# EAGLE design Quark.One (EAGLE 7.3.0)
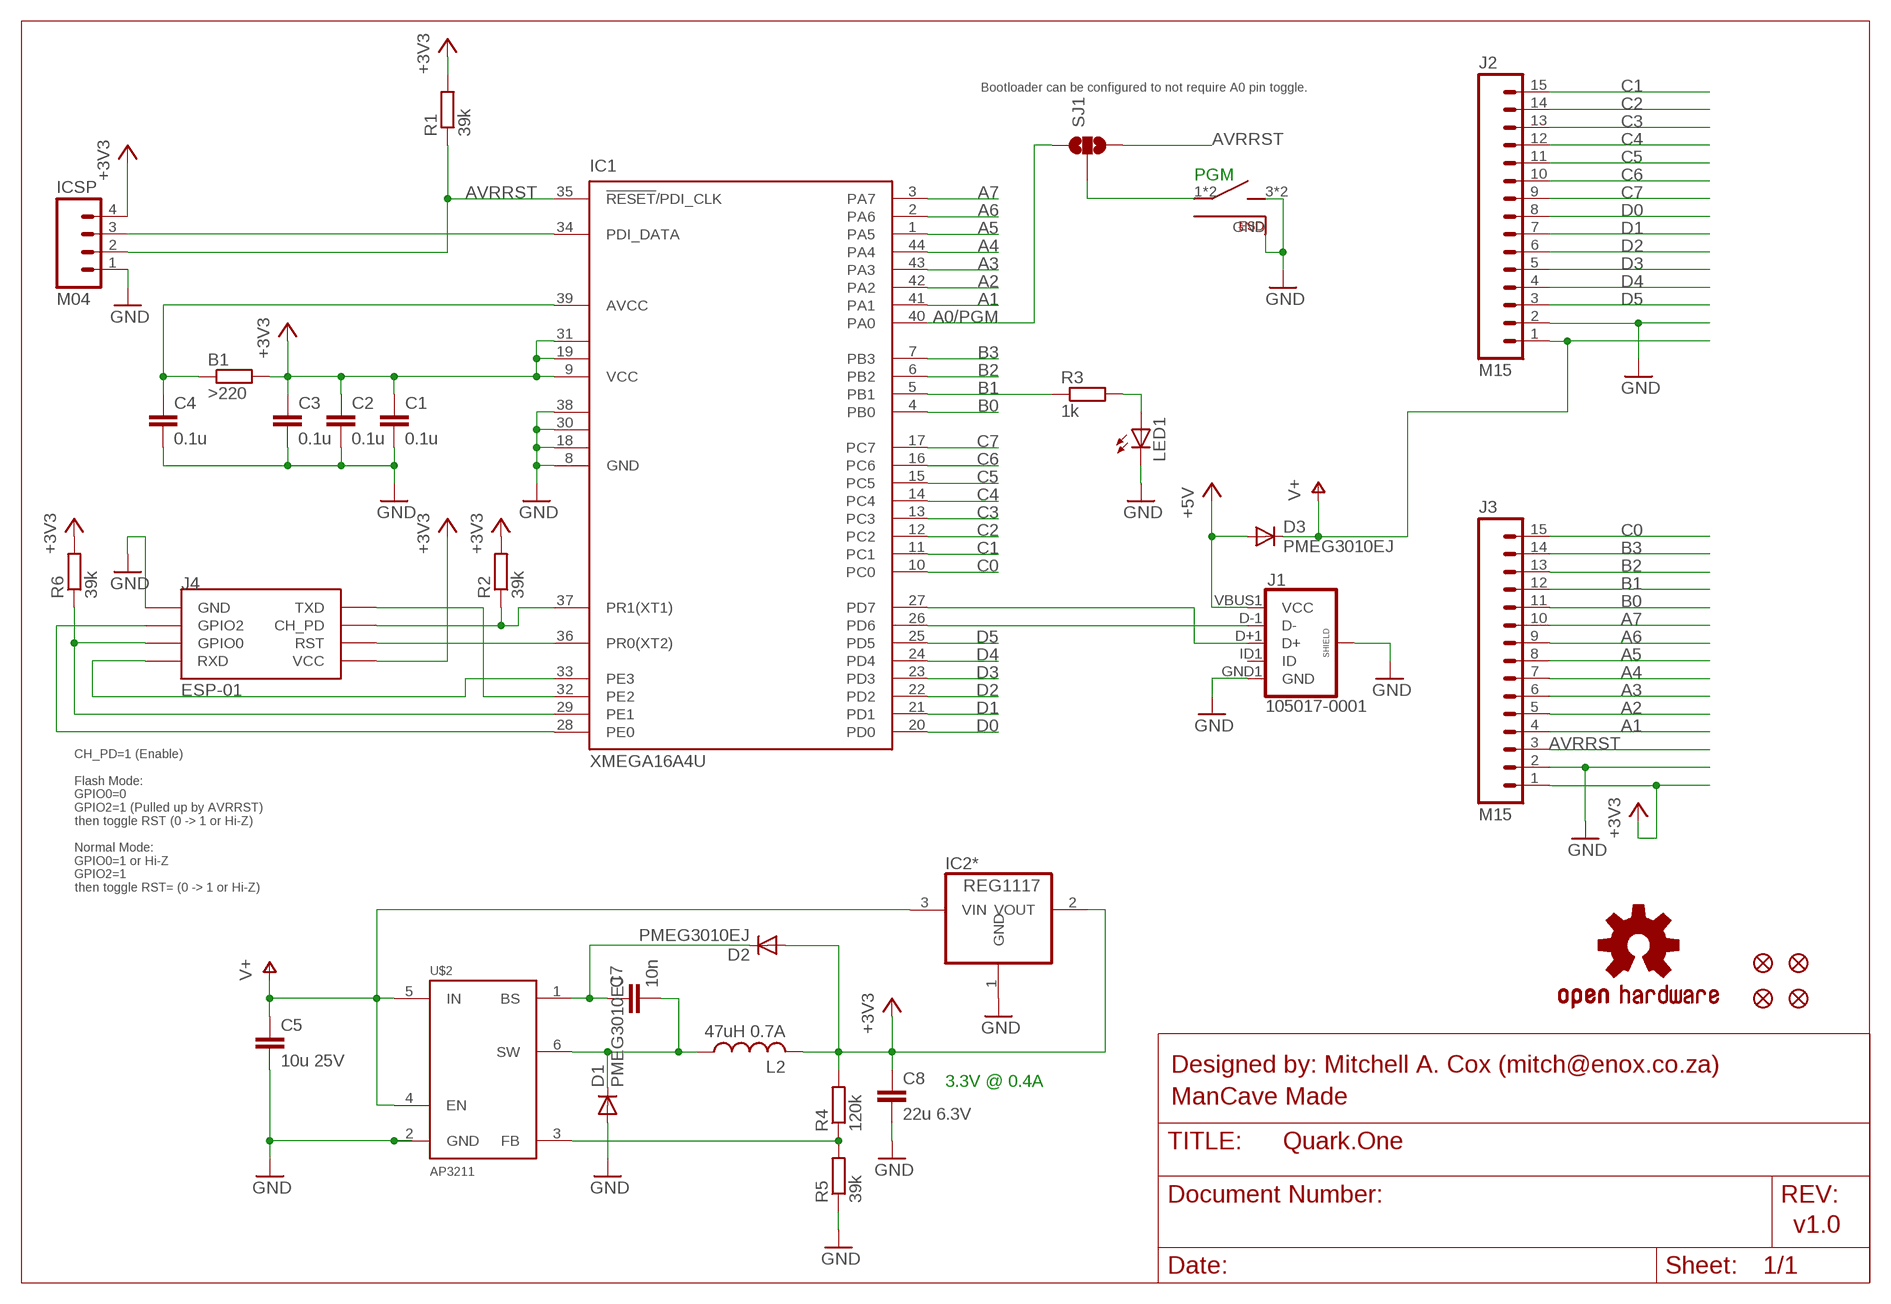
[diagram p0: schematic, sheet 1]

## Parts
B1  >220  R-EU_R0603  [R0603]
C1  0.1u  C-EUC0603  [C0603]
C2  0.1u  C-EUC0603  [C0603]
C3  0.1u  C-EUC0603  [C0603]
C4  0.1u  C-EUC0603  [C0603]
C5  10u 25V  C-EUC0805  [C0805]
C7  10n  C-EUC0603  [C0603]
C8  22u 6.3V  C-EUC0805  [C0805]
D1  PMEG3010EJ  DIODESOD  [SOD-323]
D2  PMEG3010EJ  DIODESOD  [SOD-323]
D3  PMEG3010EJ  DIODESOD  [SOD-323]
IC1  XMEGA16A4U  XMEGA16A4A  [TQFP44]
IC2*  REG1117  [SOT223]
ICSP  M04  [1X04-LOCK]
J1  105017-0001  USB-MICRO  [USB-MICROB]
J2  M15  [1X15]
J3  M15  [1X15]
J4  ESP-01  ESP01  [ESP01]
JP1  FIDUCIALUFIDUCIAL  [MICRO-FIDUCIAL]
JP2  FIDUCIALUFIDUCIAL  [MICRO-FIDUCIAL]
JP3  FIDUCIALUFIDUCIAL  [MICRO-FIDUCIAL]
JP4  FIDUCIALUFIDUCIAL  [MICRO-FIDUCIAL]
L2  47uH 0.7A  L  [LQH44P]
LED1  LEDCHIPLED_0603  [CHIPLED_0603]
R1  39k  R-EU_R0603  [R0603]
R2  39k  R-EU_R0603  [R0603]
R3  1k  R-EU_R0603  [R0603]
R4  120k  R-EU_R0603  [R0603]
R5  39k  R-EU_R0603  [R0603]
R6  39k  R-EU_R0603  [R0603]
S1  PTS840  [PTS840-SW]
SJ1  SOLDERJUMPER_2WAY-OLDPASTE2&3  [SJ_3_PASTE2&3]
U$1  OSHW  [OSHW-S]
U$2  AP3211  [SOT23-6]

## Nets
+3V3: B1.2 C1.1 C2.1 C3.1 C8.1 D2.2(A) IC1.9(VCC) IC1.19(VCC1) IC1.31(VCC2) IC2*.2(VOUT) ICSP.4 J3.1 J4.VCC L2.2 R1.2 R2.2 R4.2 R6.2
+5V: D3.2(A) J1.VBUS1(VCC)
A0/PGM: IC1.40(PA0) SJ1.1
A1: IC1.41(PA1) J3.4
A2: IC1.42(PA2) J3.5
A3: IC1.43(PA3) J3.6
A4: IC1.44(PA4) J3.7
A5: IC1.1(PA5) J3.8
A6: IC1.2(PA6) J3.9
A7: IC1.3(PA7) J3.10
AVRRST: IC1.35(!RESET!/PDI_CLK) ICSP.2 J3.3 R1.1 SJ1.3
B0: IC1.4(PB0) J3.11
B1: IC1.5(PB1) J3.12 R3.1
B2: IC1.6(PB2) J3.13
B3: IC1.7(PB3) J3.14
C0: IC1.10(PC0) J3.15
C1: IC1.11(PC1) J2.15
C2: IC1.12(PC2) J2.14
C3: IC1.13(PC3) J2.13
C4: IC1.14(PC4) J2.12
C5: IC1.15(PC5) J2.11
C6: IC1.16(PC6) J2.10
C7: IC1.17(PC7) J2.9
D0: IC1.20(PD0) J2.8
D1: IC1.21(PD1) J2.7
D2: IC1.22(PD2) J2.6
D3: IC1.23(PD3) J2.5
D4: IC1.24(PD4) J2.4
D5: IC1.25(PD5) J2.3
GND: C1.2 C2.2 C3.2 C4.2 C5.2 C8.2 D1.2(A) IC1.8(GND) IC1.18(GND1) IC1.30(GND2) IC1.38(GND3) IC2*.1(GND) ICSP.1 J1.GND1(GND) J1.P$1(SHIELD) J1.P$2(SHIELD) J1.P$7(SHIELD) J1.P$8(SHIELD) J1.SHIELD J1.SHIELD2(SHIELD) J2.2 J3.2 J4.GND LED1.C R5.1 S1.3 S1.4 S1.GND U$2.2(GND)
N$1: LED1.A R3.2
N$2: IC1.32(PE2) J4.TX(TXD)
N$3: C7.2 D1.1(C) L2.1 U$2.6(SW)
N$4: IC1.34(PDI_DATA) ICSP.3
N$5: B1.1 C4.1 IC1.39(AVCC)
N$6: R4.1 R5.2 U$2.3(FB)
N$7: IC1.33(PE3) J4.RX(RXD)
N$8: IC1.26(PD6) J1.D-1(D-)
N$9: IC1.27(PD7) J1.D+1(D+)
N$10: C7.1 D2.1(C) U$2.1(BS)
N$12: IC1.37(PR1(XT1)) J4.CH_PD R2.1
N$13: IC1.36(PR0(XT2)) J4.RST
N$14: IC1.28(PE0) J4.GPIO2
N$15: IC1.29(PE1) J4.GPIO0 R6.1
N$17: S1.1 S1.2 SJ1.2
V+: C5.1 D3.1(C) IC2*.3(VIN) J2.1 U$2.4(EN) U$2.5(IN)
Unconnected: J1.ID1(ID)

## Notes on the sheet
- Bootloader can be configured to not require A0 pin toggle.
- PGM
- CH_PD=1 (Enable)
  
  Flash Mode:
  GPIO0=0
  GPIO2=1 (Pulled up by AVRRST)
  then toggle RST (0 -> 1 or Hi-Z)
  
  Normal Mode:
  GPIO0=1 or Hi-Z
  GPIO2=1
  then toggle RST= (0 -> 1 or Hi-Z)
- 3.3V @ 0.4A
- Designed by: Mitchell A. Cox (mitch@enox.co.za)
  ManCave Made
- v1.0

## Library data of the parts
B1 R1-R6 = rcl:R-EU_: RESISTOR, European symbol
C1-C5 C7 C8 = rcl:C-EU: CAPACITOR, European symbol
D1-D3 = SparkFun:DIODE: Diode These are standard reverse protection diodes and small signal diodes. SMA package can handle up to about 1A. SOD-323 can handle about 200mA. What the SOD-323 package when ordering, there are some mfgs out there that are 5-pin packages.
IC1 = atmel:XMEGA16A4: MICROCONTROLLER Features High-performance, Low-power 8/16-bit AVR XMEGA Microcontroller Non-Volatile Program and Data Memories - 16 KB - 128 KB of In-System Self-Programmable Flash - 4 KB - 8 KB Boot Code Section with Independent Lock Bits - 1 KB - 2 KB EEPROM - 2 KB - 8 KB Internal SRAM Peripheral Features - Four-channel DMA Controller with support for external requests - Eight-channel Event System - Five 16-bit Timer/Counters Three Timer/Counters with 4 Output Compare or Input Capture channels Two Timer/Counters with 2 Output Compare or Input Capture channels High-Resolution Extensions on all Timer/Counters Advanced Waveform Extension on one Timer/Counter - Five USARTs IrDA Extension on one USART - Two Two-Wire Interfaces with dual address match (I2C and SMBus compatible) - Two SPIs (Serial Peripheral Interfaces) peripherals - AES and DES Crypto Engine - 16-bit Real Time Counter with Separate Oscillator - One Twelve-channel, 12-bit, 2 Msps Analog to Digital Converter - One Two-channel, 12-bit, 1 Msps Digital to Analog Converter - Two Analog Comparators with Window compare function - External Interrupts on all General Purpose I/O pins - Programmable Watchdog Timer with Separate On-chip Ultra Low Power Oscillator Special Microcontroller Features - Power-on Reset and Programmable Brown-out Detection - Internal and External Clock Options with PLL - Programmable Multi-level Interrupt Controller - Sleep Modes: Idle, Power-down, Standby, Power-save, Extended Standby - Advanced Programming, Test and Debugging Interfaces PDI (Program and Debug Interface) for programming, test and debugging I/O and Packages - 34 Programmable I/O Lines - 44 - lead TQFP - 44 - pad VQFN/QFN - 49 - ball VFBGA Operating Voltage - 1.6 - 3.6V Speed performance - 0 - 12 MHz @ 1.6 - 3.6V - 0 - 32 MHz @ 2.7 - 3.6V Drawn by Dipl.-Ing. (FH) Robert Siegler Created: 27.05.09; OC_FARNELL: unknown; OC_NEWARK: unknown
IC2* = burr-brown:REG1117: 800mA and 1A Low Dropout (LDO) Positive Regulator 1.8V, 2.5V, 2.85V, 3.3V, 5V, and Adj; MPN: REG1117; OC_FARNELL: 1097566; OC_NEWARK: 14P6981
ICSP = Custom:M04
J1 = Custom:USB-MICRO
J2 J3 = SparkFun:M15: Header 15 Standard 15-pin 0.1" header. Use with straight break away headers (SKU : PRT-00116), right angle break away headers (PRT-00553), swiss pins (PRT-00743), machine pins (PRT-00117), and female headers (PRT-00115).
J4 = esp8266modules:ESP01: ESP8266 Wifi module 01
JP1-JP4 = SparkFun:FIDUCIAL: Fiducial Alignment Points Various fiducial points for machine vision alignment.
L2 = VReg:L
LED1 = led:LED: LED OSRAM: - CHIPLED LG R971, LG N971, LY N971, LG Q971, LY Q971, LO R971, LY R971 LH N974, LH R974 LS Q976, LO Q976, LY Q976 LO Q996 - Hyper CHIPLED LW Q18S LB Q993, LB Q99A, LB R99A - SideLED LS A670, LO A670, LY A670, LG A670, LP A670 LB A673, LV A673, LT A673, LW A673 LH A674 LY A675 LS A676, LA A676, LO A676, LY A676, LW A676 LS A679, LY A679, LG A679 - Hyper Micro SIDELED® LS Y876, LA Y876, LO Y876, LY Y876 LT Y87S - SmartLED LW L88C, LW L88S LB L89C, LB L89S, LG L890 LS L89K, LO L89K, LY L89K LS L896, LA L896, LO L896, LY L896 - TOPLED LS T670, LO T670, LY T670, LG T670, LP T670 LSG T670, LSP T670, LSY T670, LOP T670, LYG T670 LG T671, LOG T671, LSG T671 LB T673, LV T673, LT T673, LW T673 LH T674 LS T676, LA T676, LO T676, LY T676, LB T676, LH T676, LSB T676, LW T676 LB T67C, LV T67C, LT T67C, LS T67K, LO T67K, LY T67K, LW E67C LS E67B, LA E67B, LO E67B, LY E67B, LB E67C, LV E67C, LT E67C LW T67C LS T679, LY T679, LG T679 LS T770, LO T770, LY T770, LG T770, LP T770 LB T773, LV T773, LT T773, LW T773 LH T774 LS E675, LA E675, LY E675, LS T675 LS T776, LA T776, LO T776, LY T776, LB T776 LHGB T686 LT T68C, LB T68C - Hyper Mini TOPLED® LB M676 - Mini TOPLED Santana® LG M470 LS M47K, LO M47K, LY M47K Source: http://www.osram.convergy.de LUXEON: - LUMILED® LXK2-PW12-R00, LXK2-PW12-S00, LXK2-PW14-U00, LXK2-PW14-V00 LXK2-PM12-R00, LXK2-PM12-S00, LXK2-PM14-U00 LXK2-PE12-Q00, LXK2-PE12-R00, LXK2-PE12-S00, LXK2-PE14-T00, LXK2-PE14-U00 LXK2-PB12-K00, LXK2-PB12-L00, LXK2-PB12-M00, LXK2-PB14-N00, LXK2-PB14-P00, LXK2-PB14-Q00 LXK2-PR12-L00, LXK2-PR12-M00, LXK2-PR14-Q00, LXK2-PR14-R00 LXK2-PD12-Q00, LXK2-PD12-R00, LXK2-PD12-S00 LXK2-PH12-R00, LXK2-PH12-S00 LXK2-PL12-P00, LXK2-PL12-Q00, LXK2-PL12-R00 Source: www.luxeon.com KINGBRIGHT: KA-3528ASYC Source: www.kingbright.com
S1 = Custom:PTS840
SJ1 = SparkFun:SOLDERJUMPER_2WAY-OLD: Solder Jumper 2 way solder jumper
U$1 = Custom:OSHW
U$2 = VReg:AP3211

## Board
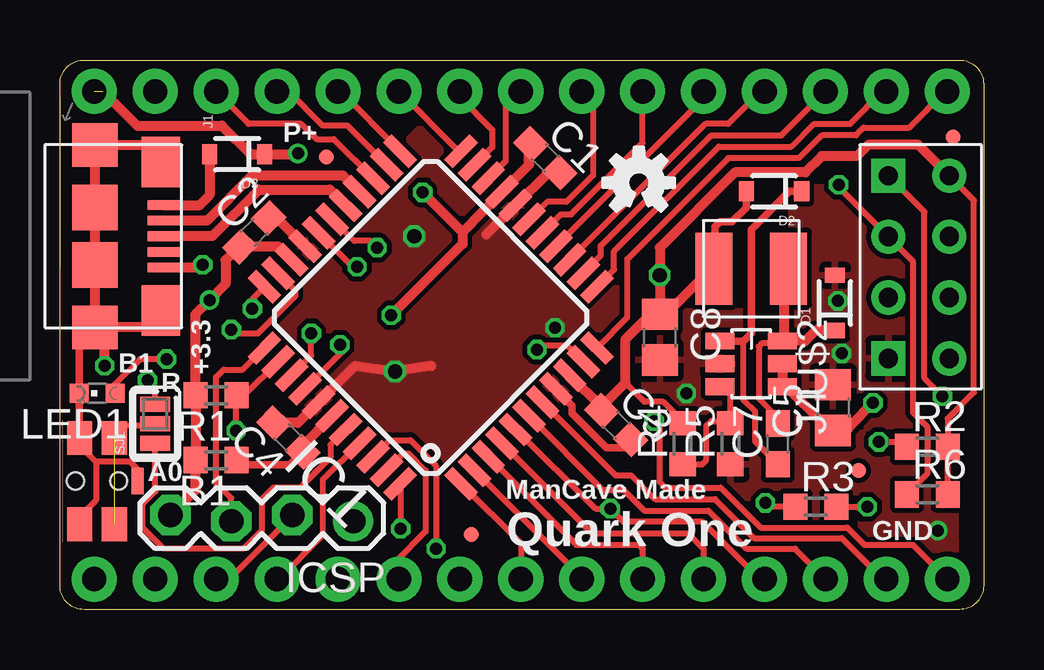
[diagram p1: board, top side]
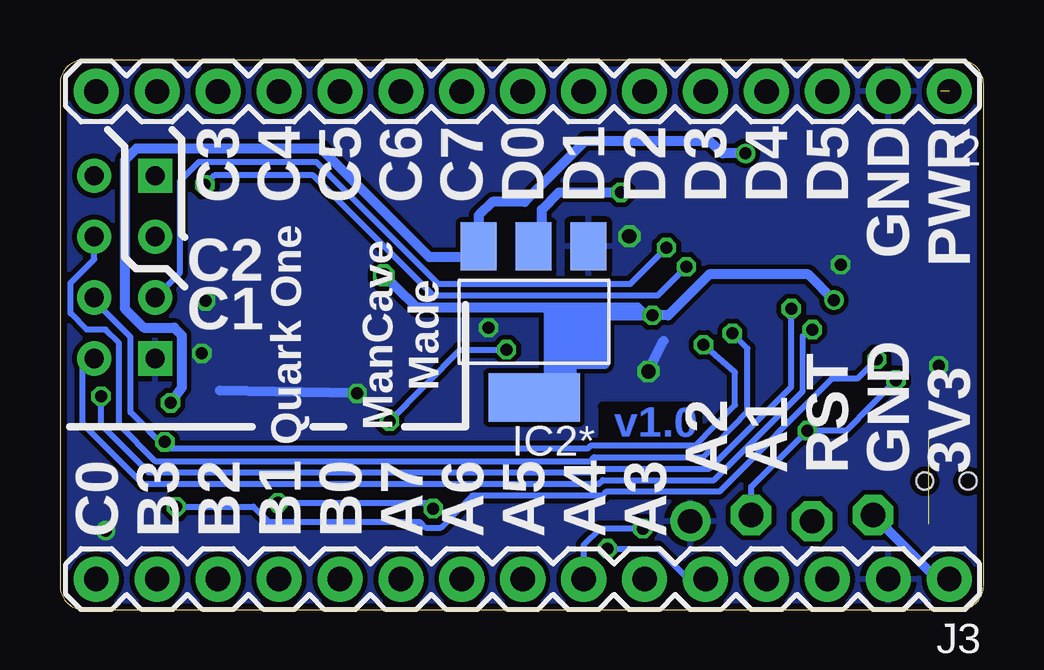
[diagram p2: board, bottom side, seen from below]

Size 38.5 x 22.9 mm. Coordinates in mm from the lower left corner, seen from the top.
Outline: 1,22.9 37.5,22.9 arc-90 38.5,21.9 38.5,1 arc-90 37.5,0 1,0 arc-90 0,1 0,21.9 arc-90 1,22.9
Copper layers (1*16): Top 0.035mm / dielectric 1.6mm / Bottom 0.035mm
Design rules "Elecrow_2-layer_PCB_eagle_rule *": minimum track width 6mil, minimum drill 12mil, track to track 8mil, track to pad 7mil, pad to pad 8mil, via to via 7mil, smd to smd 0mil, copper to edge 10mil, drill to drill 10mil, minimum pad ring 6mil, minimum via ring 6mil, stop-mask expansion 0mil, vias tented up to drill 100mil, thermal gap 10mil

### Footprints (pad centres in the part's own frame; a part is rotated, then mirrored left to right if it is on the bottom)
R0603 = smd 1 x 1.1: 1 -0.85,0; 2 0.85,0
C0603 = smd 1.1 x 1: 1 -0.85,0; 2 0.85,0
C0805 = smd 1.3 x 1.5: 1 -0.95,0; 2 0.95,0
SOD-323 = smd 0.63 x 0.83: 1 -1.15,0; 2 1.15,0
TQFP44 = smd 1.5 x 0.5: 1 -5.8,4; 2 -5.8,3.2; 3 -5.8,2.4; 4 -5.8,1.6; 5 -5.8,0.8; 6 -5.8,0; 7 -5.8,-0.8; 8 -5.8,-1.6; 9 -5.8,-2.4; 10 -5.8,-3.2; 11 -5.8,-4; 23 5.8,-4; 24 5.8,-3.2; 25 5.8,-2.4; 26 5.8,-1.6; 27 5.8,-0.8; 28 5.8,0; 29 5.8,0.8; 30 5.8,1.6; 31 5.8,2.4; 32 5.8,3.2; 33 5.8,4 | smd 0.5 x 1.5: 12 -4,-5.8; 13 -3.2,-5.8; 14 -2.4,-5.8; 15 -1.6,-5.8; 16 -0.8,-5.8; 17 0,-5.8; 18 0.8,-5.8; 19 1.6,-5.8; 20 2.4,-5.8; 21 3.2,-5.8; 22 4,-5.8; 34 4,5.8; 35 3.2,5.8; 36 2.4,5.8; 37 1.6,5.8; 38 0.8,5.8; 39 0,5.8; 40 -0.8,5.8; 41 -1.6,5.8; 42 -2.4,5.8; 43 -3.2,5.8; 44 -4,5.8
SOT223 = smd 1.499 x 2.007: 1 -2.261,-3.15; 2 0.025,-3.15; 3 2.311,-3.15 | smd 3.81 x 2.007: 4 0,3.15
1X04-LOCK = drill 1.016 pad 1.676: 1 0,0.127 | drill 1.016 pad 1.676 octagon: 2 2.54,-0.127; 3 5.08,0.127; 4 7.62,-0.127
USB-MICROB = smd 0.4 x 1.35: D+1 0,4.325; D-1 -0.65,4.325; GND1 1.3,4.325; ID1 0.65,4.325; VBUS1 -1.3,4.325 | smd 1.8 x 1.9: P$1 -3.8,1.45; P$2 3.8,1.45 | smd 2.1 x 1.6: P$7 3.1,4.2; P$8 -3.1,4.2 | smd 1.9 x 1.9: SHIELD -1.2,1.45; SHIELD2 1.2,1.45
1X15 = drill 1.016 pad 1.88: 1 0,0; 2 2.54,0; 3 5.08,0; 4 7.62,0; 5 10.16,0; 6 12.7,0; 7 15.24,0; 8 17.78,0; 9 20.32,0; 10 22.86,0; 11 25.4,0; 12 27.94,0; 13 30.48,0; 14 33.02,0; 15 35.56,0
ESP01 = drill 0.8 pad 1.422: CH_PD -1.285,-8.178; GPIO0 1.255,-5.638; GPIO2 -1.285,-5.638; RST 1.255,-8.178; TX -3.825,-8.178; VCC 3.795,-8.178 | drill 0.8 pad 1.422 square: GND -3.825,-5.638; RX 3.795,-5.638
MICRO-FIDUCIAL = smd 0.635 x 0.635: 1 0,0
LQH44P = smd 1.55 x 3: 1 -1.55,0; 2 1.55,0
CHIPLED_0603 = smd 0.8 x 0.8: A 0,-0.75; C 0,0.75
PTS840-SW = smd 1.4 x 1.05: 1 -1.8,0.725; 2 1.8,0.725; 3 -1.8,-0.725; 4 1.8,-0.725 | smd 1.1 x 0.5: GND 0,1.7 | hole 0.7: 0,-0.9; 0,0.9
SJ_3_PASTE2&3 = smd 0.635 x 1.27: 1 -0.813,0; 2 0,0; 3 0.813,0
SOT23-6 = smd 0.7 x 1.2: 1 -0.95,-1.3; 2 0,-1.3; 3 0.95,-1.3; 4 0.95,1.3; 5 0,1.3; 6 -0.95,1.3

### Placement (x,y rotation side)
B1  6.51,6.23 180 top
C1  20.23,18.81 315 top
C2  8.1,15.72 45 top
C3  23.19,7.69 315 top
C4  9.51,7.18 135 top
C5  32.23,8.41 90 top
C7  29.92,6.91 90 top
C8  25,11.35 270 top
D1  32.31,12.78 90 top
D2  29.77,17.42 180 top
D3  7.38,18.97 180 top
IC1  15.45,12.17 135 top
IC2*  18.73,11.99 180 bottom
ICSP  12.22,3.81 180 top
J1  0,15.56 270 top
J2  1.43,21.59 180 bottom
J3  1.43,1.27 180 bottom
J4  28.89,14.29 90 top
JP1  17.14,3.14 0 top
JP2  37.23,19.68 0 top
JP3  11.11,18.85 0 top
JP4  33.3,5.79 0 top
L2  28.81,14.21 180 top
LED1  1.55,9.01 90 top
R1  6.51,8.93 180 top
R2  36.16,6.79 0 top
R3  31.51,4.29 0 top
R4  25.96,6.91 90 top
R5  27.94,6.91 90 top
R6  36.16,4.8 0 top
S1  1.55,5.36 270 top
SJ1  3.97,7.74 90 top
U$1  24.13,17.78 0 top
U$2  28.81,10.24 270 top

### Tracks (layer width: path | path; a pad name or v marks a point on that pad's centre or on a via)
+3V3  (via drill 0.5, 0.6)
  Top 0.254: R4.2 25.82,7.99 25.16,8.65 24.37,8.65 23.57,9.45 23.57,11.27 | R2.2 36.91,7.18 | J4.VCC 38.1,17.05 38.1,9.05 37.01,7.95 R2.2 | R6.2 R2.2
  Top 0.305: 24.84,12.46 25.25,12.46 C8.1 | IC1.19 18.38,17.37 | 22.57,8.44 C3.1 | 27.78,15 27.66,14.88 27.66,14.45 L2.2 27.3,14.25 27.3,15.95 27.5,16.15 28.02,16.15 28.62,16.75 D2.2
  Top 0.356: B1.2 5.66,6.29 5.67,6.59 | 5.67,8.71 R1.2
  Top 0.406: IC1.9 22.57,8.44 23.57,9.44 23.57,11.27 24.84,12.54 24.84,12.46 | 9.65,14.56 IC1.31 9.11,15.12 7.74,15.12 C2.1 6.91,14.56 6.91,13.57 v6.23,12.9 5.64,12.3 5.64,8.95 R1.2 | IC1.19 16.79,15.73 | v15.12,17.38 15.64,16.87 16.79,15.73 | J4.VCC 35.78,19.37 33.7,19.37 33.22,18.89 31.75,18.89 31.07,18.22 28.14,18.22 25,15.08 v25,13.93 C8.1 25.24,12.54 25.48,12.54 27.78,14.84 27.78,15 | 18.38,17.37 19.55,18.54 19.55,19.33 C1.1 | 5.67,6.59 5.67,8.71 | ICSP.4 5.66,4.99 B1.2 | 16.79,15.73 16.79,15.24 v13.81,12.26
  Top 0.61: L2.2 27.25,13.41
  Top 0.813: 24.84,12.46 25.32,12.06 | 27.26,14.01 L2.2
  Bottom 0.406: v25,13.93 23.76,12.71 23.62,12.58 14.41,12.58 14.09,12.26 v13.81,12.26 | IC2*.2 18.41,15.16 18.41,16.67 17.7,17.38 v15.12,17.38 | v6.23,12.9 7.3,13.97 11.43,13.97 13.14,12.26 v13.81,12.26 | v13.81,12.26 17.18,12.26 17.18,9.13 | J3.1 1.43,1.63 | 1.43,1.63 1.55,1.47 | 1.43,1.63 2.02,1.35 ICSP.4
+5V
  Top 0.406: J1.VBUS1 5.82,16.86 6.23,17.27 D3.2
A0/PGM
  Top 0.254: IC1.40 11.27,6.86 11.27,6.35 10,5.08 8.89,5.08 8.41,4.6 8.41,3.29 7.66,2.54 4.33,2.54 3.45,3.41 3.45,4.41 3.97,4.92 SJ1.1
A1
  Top 0.254: IC1.41 10.95,5.41 10.95,3.1 9.05,1.19 J3.4
A2  (via drill 0.5)
  Top 0.254: IC1.42 13.74,7.06 14.61,7.06 15.68,5.99 v15.68,2.54 15.68,2.42
  Bottom 0.254: v15.68,2.54 13.57,2.54 12.3,1.27 J3.5
A3
  Top 0.254: IC1.43 14.31,6.51 14.53,6.51 15.24,5.79 15.24,3.25 14.05,2.06 14.17,1.63 14.13,1.43 J3.6
A4  (via drill 0.5)
  Top 0.254: IC1.44 14.21,5.29 v14.21,3.37
  Bottom 0.254: v14.21,3.37 15.99,3.37 16.67,2.7 J3.7
A5
  Top 0.254: IC1.1 19.21,2.76 J3.8
A6
  Top 0.254: IC1.2 21.75,1.35 J3.9
A7
  Top 0.254: IC1.3 21.53,2.7 24.13,2.7 24.29,2.54 J3.10
AVRRST  (via drill 0.5)
  Top 0.254: IC1.35 7.68,8.93 R1.1 7.34,8.91 v7.34,7.46 | J3.3 7.14,1.35 9.45,3.65 9.48,3.74 ICSP.2 | SJ1.3 3.97,9.21 v3.65,9.56
  Bottom 0.254: ICSP.2 9.68,5.12 v7.34,7.46 5.71,7.46 v3.65,9.56
B0
  Top 0.254: IC1.4 20.28,5.08 | 20.28,5.08 | 20.28,5.08 22.18,3.17 26.19,3.17 26.83,2.54 J3.11
B1  (via drill 0.5)
  Top 0.254: IC1.5 22.32,4.21 v22.94,4.21 23.5,3.65 26.79,3.65 29.17,1.27 J3.12 | R3.1 29.49,4.29 v29.41,4.45
  Bottom 0.254: v29.41,4.45 23.02,4.45 v22.94,4.21
B2
  Top 0.254: IC1.6 22.62,5 23.5,5 24.37,4.13 27.03,4.13 28.61,2.54 30.64,2.54 J3.13
B3
  Top 0.254: IC1.7 23.16,5.6 23.81,5.6 24.8,4.6 27.3,4.6 28.93,2.98 32.58,2.98 34.25,1.31 J3.14
C0  (via drill 0.5)
  Top 0.254: IC1.10 21.16,10.99 19.92,10.99 v19.88,10.84 | v24.77,7.86 25,7.86 25,5.32 25.24,5.08 27.54,5.08 29.21,3.41 32.82,3.41 33.54,2.7 35.56,2.7 J3.15
  Bottom 0.254: v24.77,7.86 21.83,10.84 v19.88,10.84
C1
  Top 0.254: IC1.11 23.65,12.17 23.65,14.61 27.86,18.81 30.8,18.81 31.75,19.76 33.18,19.76 33.5,20.08 35.4,20.08 36.91,21.59 J2.15
C2
  Top 0.254: IC1.12 23.1,14.16 23.1,14.92 27.46,19.29 30.48,19.29 31.43,20.24 32.94,20.24 34.29,21.59 J2.14
C3
  Top 0.254: J2.13 30.08,19.76 27.15,19.76 22.54,15.16 22.54,14.76 21.82,14.04 IC1.13
C4
  Top 0.254: IC1.14 26.91,20.24 27.86,20.24 29.21,21.59 J2.12
C5
  Top 0.254: IC1.15 26.83,21.29 J2.11
C6
  Top 0.254: J2.10 24.29,19.45 21.31,16.47 20.88,16.47 IC1.16
C7
  Top 0.254: J2.9 21.75,21.43 22.23,21.27 22.23,18.1 21.11,16.99 20.32,16.99 19.61,16.27 IC1.17
D0
  Top 0.254: IC1.20 18.57,18.69 18.57,21.19 19.21,21.83 J2.8
D1
  Top 0.254: IC1.21 18.02,19.26 18.02,20 16.67,21.35 J2.7
D2
  Top 0.254: IC1.22 16.62,19.1 J2.6
D3
  Top 0.254: IC1.23 11.69,21.59 J2.5
D4
  Top 0.254: 9.53,21.59 10.95,20.16 11.99,20.16 12.46,19.68 12.94,19.21 IC1.24 | 9.6,21.59 9.53,21.59 | 9.53,21.59 J2.4
D5
  Top 0.254: J2.3 7.86,20.24 10.06,20.24 10.7,19.61 11.41,19.61 IC1.25
GND  (via drill 0.5, 0.6)
  Top 0.254: 0.82,11.13 J1.P$2 | S1.GND 3.25,5.84 2.94,6.15 1.51,6.15 | 1.51,6.15 1.03,6.63 1.07,7.03 S1.3 | 1.51,6.15 1.51,4.56 1.07,4.13 1.07,3.93 S1.4
  Top 0.305: C3.2 23.85,6.75 22.78,6.75 21.35,8.18 21.35,8.49 20.68,9.16 IC1.8 | S1.3 0.8,7.3 LED1.C 0.8,11.11 J1.P$2
  Top 0.406: 17.78,15.63 IC1.18 20.4,18.25 C1.2 | 15.48,10.16 v13.97,9.92 12.31,10.16 IC1.38 9.93,7.78 C4.2 | J1.GND1 5.96,14.26 v5.95,14.37 | C2.2 9.09,16.27 IC1.30 | J1.P$8 3.5,19.36 J1.P$1 J1.SHIELD J1.SHIELD2 J1.P$2 | J1.P$7 3.5,11.76 J1.P$2 | v1.86,10.16 1.86,11.34 J1.P$2
  Bottom 0.406: v13.97,9.92 13.34,11.19 | v26.11,9.01 31.83,9.13
  other vias: 14.76,15.56 32.42,12.86 36.59,3.29 32.58,10.68 20.64,11.75
  pour Bottom: 0,22.86 38.66,22.86 38.81,23.02 38.81,1.27 38.89,-0.08 0,-0.08 -0.08,1.11 -0.08,22.78 0,22.78
  pour Top: 18.02,17.54 15.24,20.32 10.16,15.24 7.66,10.79 15.8,3.17 21.67,9.05 24.77,8.97 25.76,7.1 28.57,6.99 27.34,5.24 29.49,3.25 28.85,1.79 37.35,1.67 37.31,6.91 38.73,17.58 30.48,17.62 30.52,12.42 25.44,12.42
N$1  (via drill 0.5)
  Top 0.254: R3.2 v33.66,4.29 | v4.45,10.44 3.33,10.44 2.3,9.4 LED1.A
  Bottom 0.254: v33.66,4.29 30.44,4.29 29.8,3.65 23.5,3.65 23.26,3.41 22.62,3.41 21.31,4.76 15.88,4.76 15.72,4.92 10.99,4.92 6.31,9.64 5.24,9.64 v4.45,10.44
N$2  (via drill 0.5)
  Top 0.254: v7.14,11.67 7.38,11.51 8.26,11.51 9.8,13.06 9.8,13.29 9.69,13.41 9.68,13.41 IC1.32
  Bottom 0.254: v7.14,11.67 7.54,11.39 7.54,9.09 11.23,5.4 15.88,5.4 16.03,5.24 35.04,5.24 37.54,7.74 37.54,10.4 37.07,10 J4.TX
N$3
  Top 0.254: 30.19,11.11 29.29,11.11 29.13,10.95 29.13,8.81 30.08,7.86 C7.2
  Top 0.305: 30.19,11.11 U$2.6
  Top 0.406: 30.19,11.11 30.19,14.04 L2.1 | D1.1 31.51,11.63 31.07,11.19 U$2.6
  Top 0.61: L2.1 30.11,13.8
N$4
  Top 0.254: ICSP.3 7.14,4.64 6.51,5.28 6.51,9.68 6.83,10 7.62,10 IC1.34
N$5
  Top 0.305: IC1.39 | 7.48,5.87 7.83,6.03 9.56,6.03 9.96,6.43
  Top 0.356: 9.96,6.43 9.88,6.58 C4.1
  Top 0.406: 10.2,6.39 C4.1 | 10.36,6.35 10.16,6.53 C4.1 | IC1.39 10.11,6.83 C4.1 | 7.48,5.87 B1.1
N$6
  Top 0.254: R4.1 26.77,6.06 26.95,6.23 26.95,7.66 27.15,7.86 27.8,7.86 R5.2 27.94,9.45 U$2.3
N$7  (via drill 0.5)
  Top 0.254: v8.02,12.54 8.02,12.94 IC1.33 | J4.RX 36.04,16.58 36.04,9.64 v36.79,8.89
  Bottom 0.254: v8.02,12.54 8.02,9.29 11.43,5.87 16.03,5.87 16.19,5.71 34.81,5.71 36.79,7.7 v36.79,8.89
N$8
  Top 0.406: IC1.26 11.79,18.1 8.02,18.1 6.13,16.21 J1.D-1
N$9
  Top 0.406: IC1.27 11.25,17.5 8.29,17.5 6.35,15.56 J1.D+1
N$10
  Top 0.254: 28.5,11.19 28.5,8.73 28.97,8.26 28.97,7.01 C7.1
  Top 0.305: 28.49,11.19 28.81,11.51 28.81,15.84 30.4,17.42 D2.1 | 28.49,11.19 U$2.1 | 28.5,11.19 28.49,11.19
N$12  (via drill 0.5)
  Top 0.254: IC1.37 11.83,10.81 v11.67,11.03 | v34.13,6.99 35.34,6.99 R2.1
  Bottom 0.254: 34.05,6.71 16.51,6.71 16.39,6.83 12.03,6.83 10.36,8.53 10.36,9.88 v11.67,11.03 | J4.CH_PD 37.07,12.86 35.56,11.35 35.56,8.21 34.05,6.71 | 34.05,6.71 34.05,6.91 v34.13,6.99
N$13  (via drill 0.5)
  Top 0.254: IC1.36 10.48,10.59 v10.48,11.51
  Bottom 0.254: v10.48,11.51 9.84,10.87 9.84,8.26 11.71,6.35 16.23,6.35 16.39,6.19 34.53,6.19 36.04,7.7 36.04,11.11 36.59,11.67 37.39,11.67 38.06,12.34 38.06,13.61 37.07,14.6 J4.RST
N$14  (via drill 0.5)
  Top 0.254: v13.22,15.08 12.94,15.36 12.26,15.36 IC1.28 | IC1.28
  Bottom 0.254: J4.GPIO2 33.5,14.04 33.5,17.86 32.7,18.65 27.82,18.65 22.74,13.57 14.72,13.57 v13.22,15.08
N$15  (via drill 0.5)
  Top 0.254: IC1.29 12.28,14.21 v12.38,14.29 | v32.46,17.7 32.46,17.61 J4.GPIO0 35.56,14.51 35.56,8.21 36.16,7.62 36.16,5.65 R6.1
  Bottom 0.254: v12.38,14.29 13.57,13.1 22.94,13.1 27.94,18.1 32.07,18.1 v32.46,17.7
N$17  (1 unrouted)
  Top 0.254: SJ1.2 3.89,7.66 2.58,7.66 2.27,7.35 S1.1
N$18
  Bottom 0.406: 17.54,9.37 17.54,12.38 18.02,12.14 18.14,12.42 18.14,9.56
N$19
  Bottom 0.406: 17.22,10.24 15.8,10.24 15.8,12.14 16.11,12.14 16.11,10.36 16.43,10.36 16.43,12.06 16.67,12.06 16.67,10.4 16.95,10.4 16.95,12.06
N$20
  Bottom 0.406: 17.86,12.22 17.86,9.76
V+  (via drill 0.5)  (1 unrouted)
  Top 0.406: 1.79,21.59 3.21,20.16 6.75,20.16 7.94,18.97 D3.1 9.84,18.97 v9.92,19.01 | U$2.5 U$2.4 30.32,9.25 31.75,7.82 32.11,7.62 C5.1 32.63,7.26 32.98,7.7 v33.89,8.61
  Bottom 0.406: v9.92,19.01 10.87,19.01 11.43,19.53 16.59,19.53 19.13,16.99 20.48,16.99 21.04,16.42 IC2*.3 21.47,14.68 23.1,14.68 27.62,19.21 35.32,19.21 35.8,18.73 35.8,12.54 35,11.75 33.73,11.75 33.42,11.43 33.42,9.25 v33.89,8.61

### Text on the board
Bottom: v1.0
bDocu: ESP-01
tSilk: P+ | B1 | R | +3.3 | A0 | ManCave Made | Quark One | GND
bSilk: PWR | GND | D5 | D4 | D3 | D2 | D1 | D0 | C7 | C6 | C5 | C4 | C3 | C2 | C1 | Quark One / / ManCave / Made | 3V3 | GND | RST | A1 | A2 | A3 | A4 | A5 | A6 | A7 | B0 | B1 | B2 | B3 | C0